# Altium schematic sheet CH582M-Keypad.SchDoc
size A3; SheetNumber: 1; SheetTotal: 1
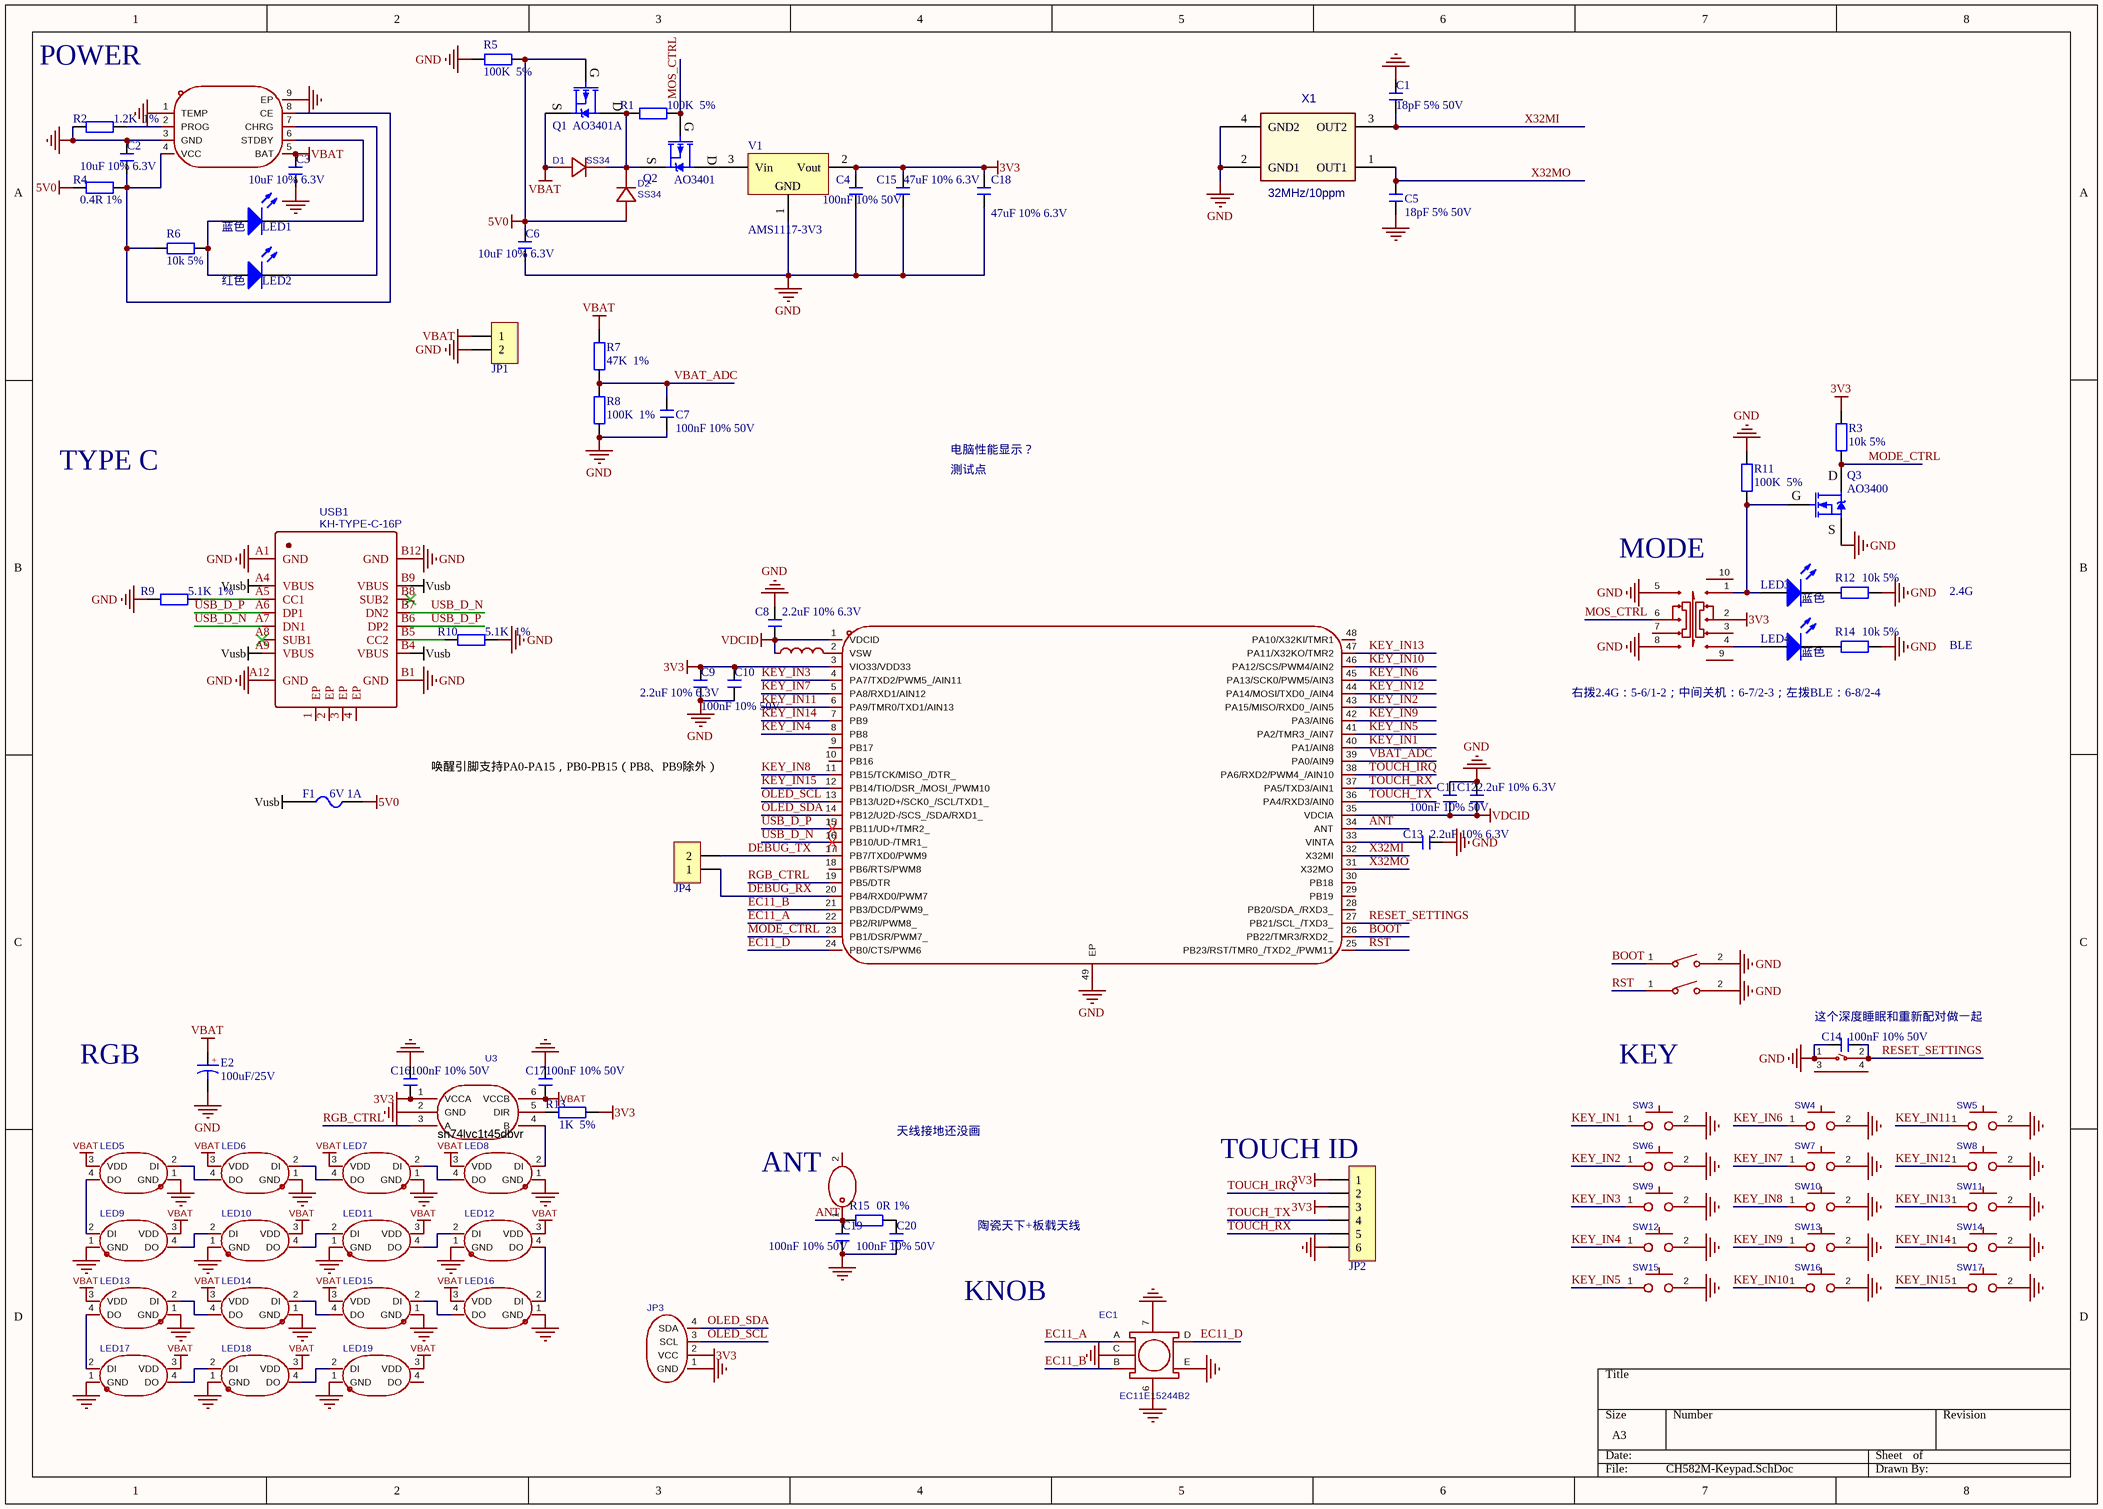
[diagram p0: CH582M-Keypad.SchDoc]

## Parts
C1  18pF 5% 50V  [C0603_L]
C2  10uF 10% 6.3V  [C0603_L]
C3  10uF 10% 6.3V  [C0603_L]
C4  100nF 10% 50V  [C0603_L]
C5  18pF 5% 50V  [C0603_L]
C6  10uF 10% 6.3V  [C0603_L]
C7  100nF 10% 50V  [C0603_L]
C8  2.2uF 10% 6.3V  [C0603_L]
C9  2.2uF 10% 6.3V  [C0603_L]
C10  100nF 10% 50V  [C0603_L]
C11  100nF 10% 50V  [C0603_L]
C12  2.2uF 10% 6.3V  [C0603_L]
C13  2.2uF 10% 6.3V  [C0603_L]
C14  100nF 10% 50V  [C0603_L]
C15  47uF 10% 6.3V  [C0805_L]
C16  100nF 10% 50V  [C0603_L]
C17  100nF 10% 50V  [C0603_L]
C18  47uF 10% 6.3V  [C0805_L]
C19  100nF 10% 50V  [C0603_L]
C20  100nF 10% 50V  [C0603_L]
D1  SS34  [SMA]
D2  SS34  [SMA]
E2  100uF/25V  [CE D(6.3*7.7)]
EC1  EC11E15244B2  [SW-TH_ALPS_EC11L1525G01]
F1  6V 1A  [F0805]
JP1  HDR-1X2  [XH2.54-LI-2P]  (value not drawn)
JP2  HDR-1X6  [CONN-SMD_6P-P1.00_ZX-SH1.0-6PLT]  (value not drawn)
JP3  HS91L02W2C01  [HDR2.54-LI-4P]  (value not drawn)
JP4  HDR-1X2  [HDR2.54-LI-2P]  (value not drawn)
L1  ftc252012s100mbca  [IND-SMD_L2.5-W2.0]  (value not drawn)
L2  rfeca3216060a1t  [ANT-SMD_L3.1-W1.6]  (value not drawn)
LED1  蓝色  [LED0603-FD]
LED2  红色  [LED0603-FD]
LED3  蓝色  [LED0603-FD]
LED4  蓝色  [LED0603-FD]
LED5  XL-6028RGBW-WS2812B  [LED-SMD_4P-L5.0-W5.0-TL_WS2812B-B]  (value not drawn)
LED6  XL-6028RGBW-WS2812B  [LED-SMD_4P-L5.0-W5.0-TL_WS2812B-B]  (value not drawn)
LED7  XL-6028RGBW-WS2812B  [LED-SMD_4P-L5.0-W5.0-TL_WS2812B-B]  (value not drawn)
LED8  XL-6028RGBW-WS2812B  [LED-SMD_4P-L5.0-W5.0-TL_WS2812B-B]  (value not drawn)
LED9  XL-6028RGBW-WS2812B  [LED-SMD_4P-L5.0-W5.0-TL_WS2812B-B]  (value not drawn)
LED10  XL-6028RGBW-WS2812B  [LED-SMD_4P-L5.0-W5.0-TL_WS2812B-B]  (value not drawn)
LED11  XL-6028RGBW-WS2812B  [LED-SMD_4P-L5.0-W5.0-TL_WS2812B-B]  (value not drawn)
LED12  XL-6028RGBW-WS2812B  [LED-SMD_4P-L5.0-W5.0-TL_WS2812B-B]  (value not drawn)
LED13  XL-6028RGBW-WS2812B  [LED-SMD_4P-L5.0-W5.0-TL_WS2812B-B]  (value not drawn)
LED14  XL-6028RGBW-WS2812B  [LED-SMD_4P-L5.0-W5.0-TL_WS2812B-B]  (value not drawn)
LED15  XL-6028RGBW-WS2812B  [LED-SMD_4P-L5.0-W5.0-TL_WS2812B-B]  (value not drawn)
LED16  XL-6028RGBW-WS2812B  [LED-SMD_4P-L5.0-W5.0-TL_WS2812B-B]  (value not drawn)
LED17  XL-6028RGBW-WS2812B  [LED-SMD_4P-L5.0-W5.0-TL_WS2812B-B]  (value not drawn)
LED18  XL-6028RGBW-WS2812B  [LED-SMD_4P-L5.0-W5.0-TL_WS2812B-B]  (value not drawn)
LED19  XL-6028RGBW-WS2812B  [LED-SMD_4P-L5.0-W5.0-TL_WS2812B-B]  (value not drawn)
Q1  AO3401A  [SOT23-3N]
Q2  AO3401  [SOT23-3N]
Q3  AO3400  [SOT23-3N]
R1  100K  5%  [R0603_L]
R2  1.2K  1%  [R0603_L]
R3  10k 5%  [R0603_L]
R4  0.4R 1%  [R2512_L]
R5  100K  5%  [R0603_L]
R6  10k 5%  [R0603_L]
R7  47K  1%  [R0603_L]
R8  100K  1%  [R0603_L]
R9  5.1K  1%  [R0603_L]
R10  5.1K  1%  [R0603_L]
R11  100K  5%  [R0603_L]
R12  10k 5%  [R0603_L]
R13  1K  5%  [R0603_L]
R14  10k 5%  [R0603_L]
R15  0R 1%  [R0603_L]
SW1  ssac120200  [SW-TH_SSAC120200]  (value not drawn)
SW2  TC-6615-5-260G  [SW-TH_4P-L7.5-W5.0-P4.50]  (value not drawn)
SW3  CPG151101S11-16  [SMD_KEYBOARD-SW]  (value not drawn)
SW4  CPG151101S11-16  [SMD_KEYBOARD-SW]  (value not drawn)
SW5  CPG151101S11-16  [SMD_KEYBOARD-SW]  (value not drawn)
SW6  CPG151101S11-16  [SMD_KEYBOARD-SW]  (value not drawn)
SW7  CPG151101S11-16  [SMD_KEYBOARD-SW]  (value not drawn)
SW8  CPG151101S11-16  [SMD_KEYBOARD-SW]  (value not drawn)
SW9  CPG151101S11-16  [SMD_KEYBOARD-SW]  (value not drawn)
SW10  CPG151101S11-16  [SMD_KEYBOARD-SW]  (value not drawn)
SW11  CPG151101S11-16  [SMD_KEYBOARD-SW]  (value not drawn)
SW12  CPG151101S11-16  [SMD_KEYBOARD-SW]  (value not drawn)
SW13  CPG151101S11-16  [SMD_KEYBOARD-SW]  (value not drawn)
SW14  CPG151101S11-16  [SMD_KEYBOARD-SW]  (value not drawn)
SW15  CPG151101S11-16  [SMD_KEYBOARD-SW]  (value not drawn)
SW16  CPG151101S11-16  [SMD_KEYBOARD-SW]  (value not drawn)
SW17  CPG151101S11-16  [SMD_KEYBOARD-SW]  (value not drawn)
SW18  ts-1088-ar02016  [SW-SMD_L3.9-W3.0-P4.45]  (value not drawn)
SW19  ts-1088-ar02016  [SW-SMD_L3.9-W3.0-P4.45]  (value not drawn)
U1  tp4056-ms  [SOP-8_L4.9-W3.9-P1.27-LS6.0-TL-EP]  (value not drawn)
U2  ch582m  [QFN-48_L5.0-W5.0-P0.35-BL-EP]  (value not drawn)
U3  sn74lvc1t45dbvr  [SOT-23-6_L2.9-W1.6-P0.95-LS2.8-BR]
USB1  KH-TYPE-C-16P  [KH-TYPE-C]
V1  AMS1117-3V3  [SOT89_L]
X1  32MHz/10ppm  [OSC-3225-4P]

## Nets
3V3: C4.2 C9.2 C10.1 C15.2 C16.1 C18.2 JP2.1 JP2.3 JP3.2(VCC) R3.1 R13.1 SW1.2 U2.3(VIO33/VDD33) U3.1(VCCA) V1.2(Vout)
5V0: C6.2 D2.1(A) F1.1 Q1.1(G) R4.1 R5.2
GND: C1.1 C2.2 C3.1 C4.1 C5.1 C6.1 C7.1 C8.2 C9.1 C10.2 C11.2 C12.1 C13.1 C14.2 C15.1 C16.2 C17.2 C18.1 C19.2 C20.2 E2.2 EC1.6 EC1.7 EC1.C EC1.E JP1.2 JP2.6 JP3.1(GND) LED5.1(GND) LED6.1(GND) LED7.1(GND) LED8.1(GND) LED9.1(GND) LED10.1(GND) LED11.1(GND) LED12.1(GND) LED13.1(GND) LED14.1(GND) LED15.1(GND) LED16.1(GND) LED17.1(GND) LED18.1(GND) LED19.1(GND) Q3.2(S) R2.2 R5.1 R8.2 R9.1 R10.2 R11.1 R12.1 R14.1 SW1.5 SW1.8 SW2.1 SW3.2 SW4.2 SW5.2 SW6.2 SW7.2 SW8.2 SW9.2 SW10.2 SW11.2 SW12.2 SW13.2 SW14.2 SW15.2 SW16.2 SW17.2 SW18.2 SW19.2 U1.1(TEMP) U1.3(GND) U1.9(EP) U2.49(EP) U3.2(GND) USB1.A1(GND) USB1.A12(GND) USB1.B1(GND) USB1.B12(GND) V1.1(GND) X1.2(GND1) X1.4(GND2)
VBAT: C3.2 C17.1 D1.1(A) E2.1 JP1.1 LED5.3(VDD) LED6.3(VDD) LED7.3(VDD) LED8.3(VDD) LED9.3(VDD) LED10.3(VDD) LED11.3(VDD) LED12.3(VDD) LED13.3(VDD) LED14.3(VDD) LED15.3(VDD) LED16.3(VDD) LED17.3(VDD) LED18.3(VDD) LED19.3(VDD) Q1.2(S) R7.1 U1.5(BAT) U3.6(VCCB)
VDCID: C8.1 C11.1 C12.2 L1.2 U2.1(VDCID) U2.35(VDCIA)
Vusb: F1.2 USB1.A4(VBUS) USB1.A9(VBUS) USB1.B4(VBUS) USB1.B9(VBUS)
ANT: C19.1 L2.1 R15.2 U2.34(ANT)
BOOT: SW18.1 U2.26(PB22/TMR3/RXD2_)
DEBUG_RX: JP4.1 U2.20(PB4/RXD0/PWM7)
DEBUG_TX: JP4.2 U2.17(PB7/TXD0/PWM9)
EC11_A: EC1.A U2.22(PB2/RI/PWM8_)
EC11_B: EC1.B U2.21(PB3/DCD/PWM9_)
EC11_D: EC1.D U2.24(PB0/CTS/PWM6)
KEY_IN1: SW3.1 U2.40(PA1/AIN8)
KEY_IN2: SW6.1 U2.43(PA15/MISO/RXD0_/AIN5)
KEY_IN3: SW9.1 U2.4(PA7/TXD2/PWM5_/AIN11)
KEY_IN4: SW12.1 U2.8(PB8)
KEY_IN5: SW15.1 U2.41(PA2/TMR3_/AIN7)
KEY_IN6: SW4.1 U2.45(PA13/SCK0/PWM5/AIN3)
KEY_IN7: SW7.1 U2.5(PA8/RXD1/AIN12)
KEY_IN8: SW10.1 U2.11(PB15/TCK/MISO_/DTR_)
KEY_IN9: SW13.1 U2.42(PA3/AIN6)
KEY_IN10: SW16.1 U2.46(PA12/SCS/PWM4/AIN2)
KEY_IN11: SW5.1 U2.6(PA9/TMR0/TXD1/AIN13)
KEY_IN12: SW8.1 U2.44(PA14/MOSI/TXD0_/AIN4)
KEY_IN13: SW11.1 U2.47(PA11/X32KO/TMR2)
KEY_IN14: SW14.1 U2.7(PB9)
KEY_IN15: SW17.1 U2.12(PB14/TIO/DSR_/MOSI_/PWM10)
MODE_CTRL: Q3.3(D) R3.2 U2.23(PB1/DSR/PWM7_)
MOS_CTRL: Q2.1(G) R1.2 SW1.6
OLED_SCL: JP3.3(SCL) U2.13(PB13/U2D+/SCK0_/SCL/TXD1_)
OLED_SDA: JP3.4(SDA) U2.14(PB12/U2D-/SCS_/SDA/RXD1_)
RESET_SETTINGS: C14.1 SW2.2 U2.27(PB21/SCL_/TXD3_)
RGB_CTRL: U2.19(PB5/DTR) U3.3(A)
RST: SW19.1 U2.25(PB23/RST/TMR0_/TXD2_/PWM11)
TOUCH_IRQ: JP2.2 U2.38(PA6/RXD2/PWM4_/AIN10)
TOUCH_RX: JP2.5 U2.37(PA5/TXD3/AIN1)
TOUCH_TX: JP2.4 U2.36(PA4/RXD3/AIN0)
USB_D_N: U2.16(PB10/UD-/TMR1_) USB1.A7(DN1) USB1.B7(DN2)
USB_D_P: U2.15(PB11/UD+/TMR2_) USB1.A6(DP1) USB1.B6(DP2)
VBAT_ADC: C7.2 R7.2 R8.1 U2.39(PA0/AIN9)
X32MI: C1.2 U2.32(X32MI) X1.3(OUT2)
X32MO: C5.2 U2.31(X32MO) X1.1(OUT1)
NetC2_1: C2.1 R4.2 R6.2 U1.4(VCC) U1.8(CE)
NetC13_2: C13.2 U2.33(VINTA)
NetC20_1: C20.1 R15.1
NetD1_2: D1.2(K) D2.2(K) Q1.3(D) Q2.2(S) R1.1
NetL1_1: L1.1 U2.2(VSW)
NetLED1_1: LED1.1(A) LED2.1(A) R6.1
NetLED1_2: LED1.2(K) U1.6(STDBY)
NetLED2_2: LED2.2(K) U1.7(CHRG)
NetLED3_1: LED3.1(A) Q3.1(G) R11.2 SW1.1
NetLED3_2: LED3.2(K) R12.2
NetLED4_1: LED4.1(A) SW1.4
NetLED4_2: LED4.2(K) R14.2
NetLED5_2: LED5.2(DI) LED6.4(DO)
NetLED5_4: LED5.4(DO) LED9.2(DI)
NetLED6_2: LED6.2(DI) LED7.4(DO)
NetLED7_2: LED7.2(DI) LED8.4(DO)
NetLED8_2: LED8.2(DI) U3.4(B)
NetLED9_4: LED9.4(DO) LED10.2(DI)
NetLED10_4: LED10.4(DO) LED11.2(DI)
NetLED11_4: LED11.4(DO) LED12.2(DI)
NetLED12_4: LED12.4(DO) LED16.2(DI)
NetLED13_2: LED13.2(DI) LED14.4(DO)
NetLED13_4: LED13.4(DO) LED17.2(DI)
NetLED14_2: LED14.2(DI) LED15.4(DO)
NetLED15_2: LED15.2(DI) LED16.4(DO)
NetLED17_4: LED17.4(DO) LED18.2(DI)
NetLED18_4: LED18.4(DO) LED19.2(DI)
NetQ2_3: Q2.3(D) V1.3(Vin)
NetR2_1: R2.1 U1.2(PROG)
NetR9_2: R9.2 USB1.A5(CC1)
NetR10_1: R10.1 USB1.B5(CC2)
NetR13_2: R13.2 U3.5(DIR)

Not connected (* = marked no-connect by the designer): L2 2; LED19 4(DO); SW1 3 7 9 10; SW2 3 4; U2 9(PB17) 10(PB16) 18(PB6/RTS/PWM8) 28(PB20/SDA_/RXD3_) 29(PB19) 30(PB18) 48(PA10/X32KI/TMR1); USB1 1(EP) 2(EP) 3(EP) 4(EP) A8(SUB1)* B8(SUB2)*

## Layout directives
differential pair: USB_D_N, USB_D_P

## Notes on the sheet
- POWER
- 电脑性能显示？
- TYPE C
- 测试点
- (near SW1) MODE
- BLE
- 2.4G
- 右拨2.4G：5-6/1-2；中间关机：6-7/2-3；左拨BLE：6-8/2-4
- 唤醒引脚支持PA0-PA15，PB0-PB15（PB8、PB9除外）
- 这个深度睡眠和重新配对做一起
- RGB
- KEY
- (near L2) ANT
- 天线接地还没画
- (near JP2) TOUCH ID
- 陶瓷天下+板载天线
- KNOB
- (in symbol CE_SMD) +

## Library data of the parts
C1-C20 = C: 贴片电容; BOM名称: 无极性贴片电容; 优秀评价可免费更新: 联系淘宝ID：黄晶宝石，获取更新版封装库; 卖家免费技术支持，联系售后: 唯一出售店铺网址https://shop463601444.taobao.com; 本封装库来自淘宝卖家 ID：黄晶宝石: 其他店铺购入均为盗版，请立即申请退款
D1 D2 = 1N4007(M7): 正向压降(Vf):1.1V@1A;直; Manufacturer: UMW(友台半导体); AddInBom: yes; ModelId: 5b7d57c23c9f472788911caf890f0710聨0819f05c4eef4c71ace90d822a990e87; ModelName: SMA_L4.3-W2.7-LS5.1-RD; ModelTransform: 198.4248,106.299,0,0,0,0,0,0,0; Voltage - DC Reverse(Vr): 1kV; Current - Rectified: 800mA; Reverse Leakage Current (Ir): 5uA@1kV; Non-Repetitive Peak Forward Surge Current: 30A; Operating Junction Temperature Range: -55℃~+150℃; Symbol: 1N4007(M7); Device: 1N4007(M7); LCSC Part Name: 1N4007(M7); SupplierPart: C2988638; ManufacturerPart: 1N4007(M7); Supplier Footprint: SMA(DO-214AC); JLCPCB Part Class: Extended Part; Datasheet: https://item.szlcsc.com/datasheet/1N4007(M7)/3446980.html; Supplier: LCSC; ConvertToPcb: yes; FootprintName: SMA_L4.3-W2.7-LS5.1-RD; Voltage - Forward(Vf@If): 1.1V@1A
E2 = CE_SMD: 贴片电解电容; 当前库版本V2023.10.25 @淘宝卖家:黄晶宝石: 最新版本发布https://item.taobao.com/item.htm?id=566775463719; BOM名称: 贴片电解电容
EC1 = EC11E15244B2_C470754: Manufacturer: ALPSALPINE(阿尔卑斯阿尔派); AddInBom: yes; ModelId: b9ea73ddb58141e1968840257f42eaba; ModelName: SW-TH_EC11XXXXXXXX-L11.7-W12.0-H24.5-P2.5-LS14.5; ModelTransform: 495.18696,578.739,0,0,0,0,0,0,-137.795; Symbol: EC11E15244B2; Device: EC11E15244B2_C470754; LCSC Part Name: EC11E15244B2; SupplierPart: C470754; ManufacturerPart: EC11E15244B2; Supplier Footprint: 插件; JLCPCB Part Class: 扩展库; Datasheet: https://atta.szlcsc.com/upload/public/pdf/source/20191216/C470795_DE763ECE59BD49533DB26DB53E5D34B2.pdf; Supplier: LCSC; ConvertToPcb: yes; FootprintName: SW-TH_EC11XXXXXXXX
F1 = FUSE 1808: 0805自恢复保险座; BOM名称: 1808保险座; 当前库版本V2023.10.25 @淘宝卖家:黄晶宝石: 最新版本发布https://item.taobao.com/item.htm?id=566775463719
JP1 JP4 = Header 2: 2P接插件; 联系卖家，免费查找封装: 唯一出售店铺网址https://shop463601444.taobao.com; 封装库来自淘宝卖家ID：黄晶宝石: 其他店铺购入均为盗版封装库，请立即申请退款，本店现金奖励50~200元; BOM名称: 2P接插件
JP2 = Header 6: 6P接插件; 联系卖家，免费查找封装: 唯一出售店铺网址https://shop463601444.taobao.com; 封装库来自淘宝卖家ID：黄晶宝石: 其他店铺购入均为盗版封装库，请立即申请退款，本店现金奖励50~200元; BOM名称: 6P接插件
JP3 = HS91L02W2C01: 主控芯片:SSD1306;接口类型:I2C;尺寸(inch):0.91;像素分辨率:128x32;; Manufacturer: HS(汉昇); AddInBom: yes; ModelId: e9c242a236b948d0b006944114bb4dcb; ModelName: OLED-TH_L38.0-W12.0_HS91L02W2C01; ModelTransform: 1496.06,472.44,0,0,0,0,688.975,0,0; Interface Type: I2C; Pixel Resolution: 128x32; Symbol: HS91L02W2C01; Device: HS91L02W2C01; LCSC Part Name: 0.91寸OLED显示屏白光IIC; SupplierPart: C5248081; ManufacturerPart: HS91L02W2C01; Supplier Footprint: -; JLCPCB Part Class: 扩展库; Datasheet: https://atta.szlcsc.com/upload/public/pdf/source/20230727/C3E43C8E3DDA847F5681FEE7D95C153D.pdf; Supplier: LCSC; ConvertToPcb: yes; FootprintName: OLED-TH_L38.0-W12.0_HS91L02W2C01; Main Control Chip: SSD1306; Size: 0.91; Operating Temperature: -40℃~+70℃
L1 = ftc252012s100mbca: 电感值:10uH;精度:±20%;额定电流:1.2A;饱和电流(Isat):1.6A;类型:一体成型电感;; Manufacturer: cjiang(长江微电); AddInBom: yes; ModelId: 85d117b4abb34d9087271edcd9ba0330; ModelName: IND-SMD_L2.5-W2.0-H1.2; ModelTransform: 99.2124,78.74,0,0,0,0,0,0,0; Value: 10uH; Tolerance: ±20%; Rated Current: 1.2A; Saturation Current (Isat): 1.6A; DC Resistance (DCR): 330mΩ; Type: 一体成型电感; Symbol: FTC252012S100MBCA; LCSC Part Name: 10uH ±20% 1.6A; SupplierPart: C5832376; ManufacturerPart: FTC252012S100MBCA; Supplier Footprint: SMD,2x2.5mm; JLCPCB Part Class: Extended Part; Datasheet: https://atta.szlcsc.com/upload/public/pdf/source/20230602/8FFEDA9C0247A92A0D4B67554BFE4091.pdf; Supplier: LCSC; ConvertToPcb: yes; FootprintName: IND-SMD_L2.5-W2.0
L2 = rfeca3216060a1t: 天线类型:陶瓷天线;中心频点:2.4GHz;带宽:-;峰值增益:2dBi;极化方式:-;功率容量:-;驻波比:2.1;; Manufacturer: Walsin(华新科); AddInBom: yes; ModelId: fe75f6c932bd483aac67fd9557788572; ModelName: ANT-SMD_L3.1-W1.6-H0.6; ModelTransform: 122.047,62.992,0,0,0,0,-0.0005,0,0; Antenna Type: 陶瓷天线; Central Frequency: 2.4GHz; Peak Gain: 2dBi; VSWR: 2.1; Symbol: RFECA3216060A1T; LCSC Part Name: 2.4 GHz ISM频段工作频率的陶瓷天线; SupplierPart: C127620; ManufacturerPart: RFECA3216060A1T; Supplier Footprint: 1206; JLCPCB Part Class: Extended Part; Datasheet: https://atta.szlcsc.com/upload/public/pdf/source/20180326/C127620_3C564CCA307EE04222EAFCE04B7FD99A.pdf; Supplier: LCSC; ConvertToPcb: yes; FootprintName: ANT-SMD_L3.1-W1.6; Bandwidth: -; Polarization Type: -; Impedance: -; Power capacity: -; Operating Temperature: -
LED1-LED4 = LED: 贴片LED; 封装库来自淘宝卖家：黄晶宝石: 其他店铺购入均为盗版封装库，无更新权益，请立即申请退款，本店现金奖励200~1000元; BOM名称: 贴片LED
LED5-LED19 = XL-6028RGBW-WS2812B: 6028幻彩雾状（ws2812b); Manufacturer: XINGLIGHT(成兴光); AddInBom: yes; ModelId: f871e855884f4e26969d7bb9f17c076a; ModelName: LED-SMD_4P-L3.2-W2.8-XL-6028RGBW-WS2812B; ModelTransform: 232.283,110.349,0,0,0,0,0,0.001,-33.465; Wavelength: 515nm；620nm~630nm；525nm; Luminous Intensity: 800mcd；150mcd；180mcd; Peak Wavelength: 525nm；475nm；625nm; Symbol: XL-6028RGBW-WS2812B; Device: XL-6028RGBW-WS2812B; LCSC Part Name: XL-6028RGBW-WS2812B; SupplierPart: C42163197; ManufacturerPart: XL-6028RGBW-WS2812B; Supplier Footprint: SMD-4P,3.2x2.8mm; JLCPCB Part Class: 扩展库; Datasheet: https://atta.szlcsc.com/upload/public/pdf/source/20241024/FC25C683F3142850CC3F64F8BA37BD57.pdf; Supplier: LCSC; ConvertToPcb: yes; FootprintName: LED-SMD_4P-L3.2-W2.8-XL-6028RGBW-WS2812B; Quiescent Current: -; Lens Color: -; Operating Temperature: -40℃~+85℃
Q1 Q2 = AO3401: P沟道 30V/4.2A; BOM名称: 场效应管; 联系下单店铺卖家 免费帮你查找封装: 联系下单店铺卖家 免费技术支持; 参数: P沟道 30V/4.2A
Q3 = AO3400: N沟道 30V/4.2A; BOM名称: 场效应管; 联系下单店铺卖家 免费帮你查找封装: 联系下单店铺卖家 免费技术支持; 参数: N沟道 30V/4.2A
R1-R15 = R: 贴片电阻; 优秀评价可免费更新: 联系淘宝ID：黄晶宝石，获取更新版封装库; 卖家免费技术支持，联系售后: 唯一出售店铺网址https://shop463601444.taobao.com; 本封装库来自淘宝卖家 ID：黄晶宝石: 其他店铺购入均为盗版，请立即申请退款; BOM名称: 贴片电阻
SW1 = ssac120200: 电路结构:双刀三掷;安装方式:-;开关颜色:-;额定电流:1mA;额定电压:5V;工作寿命:1万次;; Manufacturer: ALPSALPINE(阿尔卑斯阿尔派); AddInBom: yes; ModelId: 2ce2af0905d543ceb34b49dd48907a61; ModelTransform: 433.07,389.763,0,0,0,0,0,-86.024,-98.425; Circuit: 双刀三掷; Switch Height: 9.9mm; Current Rating: 1mA; Voltage Rating: 5V; Life: 1万次; Symbol: SSAC120200; LCSC Part Name: 滑动开关; SupplierPart: C398944; ManufacturerPart: SSAC120200; Supplier Footprint: 插件; JLCPCB Part Class: Extended Part; Datasheet: https://item.szlcsc.com/datasheet/SSAC120200/381567.html; Supplier: LCSC; ConvertToPcb: yes; FootprintName: SW-TH_SSAC120200; ModelName: SW-TH_SSAC120200; Actuator Style: -; Termination Style: PC引脚; Length: -; Width: -; Mounting Type: -; Actuator Color: -; Operating Temperature: -10℃~+60℃
SW3-SW17 = CPG151101S11-16: 热插拔底座连接器 键盘配件; Manufacturer: HanElectricity(瀚源); AddInBom: yes; ModelId: 5c2d585f6c544fcf92e7ed163bda57d3; ModelTransform: 582.676,231.8893,0,0,0,0,0,0,-47.244; Device: CPG151101S11-16; LCSC Part Name: 热插拔底座连接器 键盘配件; SupplierPart: C41430893; ManufacturerPart: CPG151101S11-16; Supplier Footprint: SMD,14.5x5.9mm; JLCPCB Part Class: 扩展库; Datasheet: https://atta.szlcsc.com/upload/public/pdf/source/20241016/CAB9C3DABBAD4306660C041376EEF732.pdf; Supplier: LCSC; ConvertToPcb: yes; SymbolName: CPG151101S11-16; FootprintName: SMD_KEYBOARD-SW; ModelName: SMD_KEYBOARD-SW
SW18 SW19 = ts-1088-ar02016: 电路结构:单刀单掷;按钮形状:圆形按钮;作用力:1.6N;安装方式:立贴;开关长度:3.9mm;开关宽度:3mm;开关高度:2mm;带支架:不带支架;触点电流:50mA;额定电压:12V;带灯:-;工作寿命:10万次;; Manufacturer: XUNPU(讯普); AddInBom: yes; ModelId: b26698b69f274ffabef8a26c7d0e5dd1; ModelName: SW-SMD_L3.9-W2.9-H2.0-LS4.8; ModelTransform: 188.976,114.174,0,0,0,0,0,0,0; Circuit: 单刀单掷; Actuator Style: 圆形按钮; Operating Force: 1.6N; Switch Height: 2mm; with Bracket: 不带支架; Contact Current: 50mA; Voltage Rating: 12V; Actuator/Cap Color: 黑色; Life: 10万次; Symbol: TS-1088-AR02016; LCSC Part Name: 3.9*3*2mm 立贴 轻触开关; SupplierPart: C720477; ManufacturerPart: TS-1088-AR02016; Supplier Footprint: SMD,4x3mm; JLCPCB Part Class: Basic Part; Datasheet: https://item.szlcsc.com/datasheet/TS-1088-AR02016/763484.html; Supplier: LCSC; ConvertToPcb: yes; FootprintName: SW-SMD_L3.9-W3.0-P4.45; Mounting Type: 立贴; Length: 3.9mm; Width: 3mm; With Lamp: -; IP Rating: -; Termination Style: SMD接片; Operating Temperature: -30℃~+80℃
U1 = tp4056-ms: 工作电压:4.2V~9V;最大充电电流:1A;电池类型:锂电池;电池节数:1;; Manufacturer: MSKSEMI(美森科); AddInBom: yes; ModelId: 4f1f5228684a45afaa7af8cce46001de; ModelName: SOP-8_L4.9-W3.9-H1.45-LS6.0-P1.27; ModelTransform: 236.22,189.751,0,0,0,0,-0.051,0.515,0; The Chip Type: 充电芯片; Charge Current - Max: 1A; Charging Saturation Voltage: 4.2V; Type of Battery: 锂电池; Number of Cells: 1; Battery Temperature Detection: 支持; Supply Current (Iq): 70uA; Symbol: TP4056-MS; LCSC Part Name: 单节锂离子电池充电器; SupplierPart: C7473158; ManufacturerPart: TP4056-MS; Supplier Footprint: SOP-8-EP; JLCPCB Part Class: Extended Part; Datasheet: https://item.szlcsc.com/datasheet/TP4056-MS/8533532.html; Supplier: LCSC; ConvertToPcb: yes; FootprintName: SOP-8_L4.9-W3.9-P1.27-LS6.0-TL-EP; Voltage - Supply: 4.2V~9V; End-Off Voltage: -; Operating Temperature: -40℃~+85℃; 0V Battery Charge: -; Balance Current: -; Interface: -; Features: 恒压充电；恒流充电；自动再充电；充电终止；软启动；可编程充电电流；欠压锁定；涓流充电
U2 = ch582m: CPU内核:RISC-V;程序存储容量:512KB;RAM总容量:32KB;GPIO端口数量:40;工作电压范围:2.3V~3.6V;CPU最大主频:80MHz;程序存储器类型:FLASH;; Manufacturer: WCH(南京沁恒); AddInBom: yes; ModelId: 4b8d4b49de7e447b9d591de0c72709ce; ModelTransform: 197.6374,197.6374,0,270,0,0,0,0,0; CPU Core: RISC-V; Program Storage Size: 512KB; RAM Size: 32KB; GPIO Ports Number: 40; CPU Maximum Speed: 80MHz; Program Memory Type: FLASH; ADC (Bit): 12bit; PWM (Bit): 26bit; 32Bit Timer: 4; I2C: 1; SPI: 2; Symbol: CH582M; LCSC Part Name: CH582M; SupplierPart: C2920766; ManufacturerPart: CH582M; Supplier Footprint: QFN-48-EP(5x5); JLCPCB Part Class: Extended Part; Datasheet: https://atta.szlcsc.com/upload/public/pdf/source/20220111/7785F6388C97C318998CCEA67CDD9164.pdf; Supplier: LCSC; ConvertToPcb: yes; FootprintName: QFN-48_L5.0-W5.0-P0.35-BL-EP; ModelName: QFN-48_L5.0-W5.0-P0.35-BL-EP; Operating Voltage Range: 2.3V~3.6V; Operating Temperature Range: -40℃~+85℃; DAC (Bit): -; 8Bit Timer: -; 16Bit Timer: -; CAN: -; UART/USART: 4; I2S: -; Universal Serial Bus: -; Internal Comparator: -; Peripheral/Function: -; communication protocol: -; Watchdog: -; Real-Time Clock: -; Infrared Data Association: -; Low-Voltage Detect: -; CCP Capture/Compare: -; Secure Digital Input and Output: -; Direct Memory Access: -; Internal Oscillator: -
U3 = sn74lvc1t45dbvr: 数据速率:420Mbps;工作电压(VCCA):1.65V~5.5V;工作电压(VCCB):1.65V~5.5V;通道数:1;每个电路通道数:1;; Manufacturer: TI(德州仪器); AddInBom: yes; ModelId: 18da8f6c14a34920b3e136b5c401a119; ModelName: SOT-23-6_L2.9-W1.6-H1.5-LS2.8-P0.95; ModelTransform: 110.73671,114.173,0,180,0,0,0.001,-0.003,0; Channel Type: 双向; Number of Circuits: 1; Output Type: 三态; Symbol: SN74LVC1T45DBVR; LCSC Part Name: SN74LVC1T45DBVR; SupplierPart: C7843; ManufacturerPart: SN74LVC1T45DBVR; Supplier Footprint: SOT-23-6; JLCPCB Part Class: Extended Part; Datasheet: https://www.ti.com/cn/lit/gpn/sn74lvc1t45; Supplier: LCSC; ConvertToPcb: yes; FootprintName: SOT-23-6_L2.9-W1.6-P0.95-LS2.8-BR; Data Rate: 420Mbps; Voltage - Supply(VCCA): 1.65V~5.5V; Voltage - Supply(VCCB): 1.65V~5.5V; Operating Temperature: -40℃~+85℃
USB1 = KH-TYPE-C-16P: BOM_Manufacturer: Shenzhen Kinghelm Elec; Contributor: LCSC; BOM_Supplier: LCSC; BOM_Supplier Part: C709357; BOM_Manufacturer Part: KH-TYPE-C-16P; BOM_JLCPCB Part Class: Extended Part; spicePre: U; spiceSymbolName: KH-TYPE-C-16P
V1 = AMS1117: 三端稳压芯片; BOM名称: 稳压芯片; 优秀评价可免费更新: 联系淘宝ID：黄晶宝石，获取更新版封装库; 卖家免费技术支持，联系售后: 唯一出售店铺网址https://shop463601444.taobao.com; 封装库来自淘宝卖家 ID：黄晶宝石: 其他店铺购入均为假冒，请立即申请退款，本店奖励2~5元现金
X1 = OSC44M_5: 晶振
SW2 = TC-6615-5-260G: Symbol: TC-6615-5-260G